# Altium schematic sheet CAN.SchDoc: QUTMS - HVBoard - CANBUS
size A4; Author: Jonn Dillon; Organization: QUT Motorsport; Address1: O-120; Address2: O Block; Address3: QUT Gardens Point; Address4: Brisbane, 4000; DocumentNumber: 1; SheetNumber: 1; SheetTotal: 7
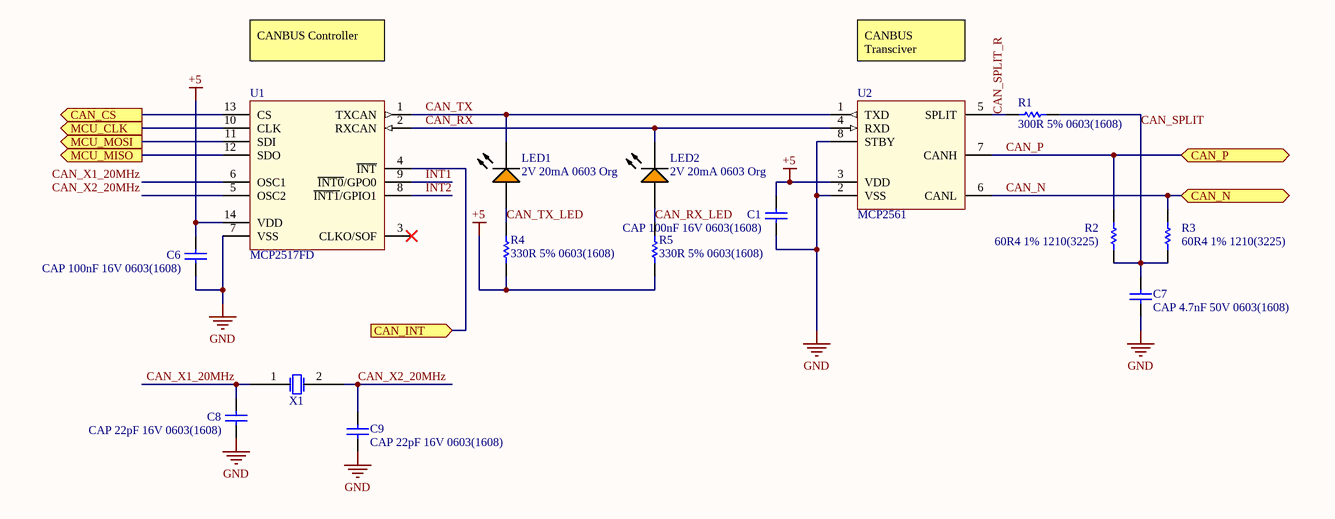
[diagram p0: CAN.SchDoc]

## Parts
C1  CAP 100nF 16V 0603(1608)  [CAPC0603(1608)100_N]
C6  CAP 100nF 16V 0603(1608)  [CAPC0603(1608)100_N]
C7  CAP 4.7nF 50V 0603(1608)  [CAPC0603(1608)100_M]
C8  CAP 22pF 16V 0603(1608)  [CAPC0603(1608)100_N]
C9  CAP 22pF 16V 0603(1608)  [CAPC0603(1608)100_N]
LED1  2V 20mA 0603 Org  [KING-LED0603-25-ORANGE_V]
LED2  2V 20mA 0603 Org  [KING-LED0603-25-ORANGE_V]
R1  300R 5% 0603(1608)  [RESC0603(1608)_N]
R2  60R4 1% 1210(3225)  [RESC1210(3225)_L]
R3  60R4 1% 1210(3225)  [RESC1210(3225)_L]
R4  330R 5% 0603(1608)  [RESC0603(1608)_L]
R5  330R 5% 0603(1608)  [RESC0603(1608)_L]
U1  MCP2517FD  [MCP2517FD SOIC]
U2  MCP2561  [MCP2561 SOIC]
X1  Crystal 20MHz  [Crystal 20MHz]  (value not drawn)

## Ports
CAN_CS (out), CAN_INT (in), CAN_N (bidir), CAN_P (bidir), MCU_CLK (out), MCU_MISO (out), MCU_MOSI (out)

## Nets
+5: C1.2 C6.2 R4.2 R5.2 U1.14(VDD) U2.3(VDD)
GND: C1.1 C6.1 C7.1 C8.1 C9.2 U1.7(VSS) U2.2(VSS) U2.8(STBY)
CAN_CS: U1.13(CS) ; port CAN_CS
CAN_INT: U1.4(~{INT}) ; port CAN_INT
CAN_N: R3.2 U2.6(CANL) ; port CAN_N
CAN_P: R2.2 U2.7(CANH) ; port CAN_P
CAN_RX: LED2.2(K) U1.2(RXCAN) U2.4(RXD)
CAN_RX_LED: LED2.1(A) R5.1
CAN_SPLIT: C7.2 R1.2 R2.1 R3.1
CAN_SPLIT_R: R1.1 U2.5(SPLIT)
CAN_TX: LED1.2(K) U1.1(TXCAN) U2.1(TXD)
CAN_TX_LED: LED1.1(A) R4.1
CAN_X1_20MHz: C8.2 U1.6(OSC1) X1.1
CAN_X2_20MHz: C9.1 U1.5(OSC2) X1.2
INT1: U1.9(~{INT0}/GPO0)
INT2: U1.8(~{INT1}/GPIO1)
MCU_CLK: U1.10(CLK) ; port MCU_CLK
MCU_MISO: U1.12(SDO) ; port MCU_MISO
MCU_MOSI: U1.11(SDI) ; port MCU_MOSI

Not connected (* = marked no-connect by the designer): U1 3(CLKO/SOF)*

## Notes on the sheet
- CANBUS Controller
- CANBUS Transciver
- Title
- Size:
- Date:
- A4
- Number:
- Time:
- Revision:
- Sheet
- of
- File:

## Library data of the parts
C1 C6 = CMP-1035-02584-1: CAP 100nF 16V ±10% 0603 (1608 Metric) Thickness 1mm SMD; Tolerance: Â±10%; Case-EIA: 0603; Case-Metric: 1608; Technology: SMT; Max Thickness: 1 mm; Value: 100nF; Rated Voltage: 16 V
C7 = CMP-1035-02202-1: CAP 4.7nF 50V ±5% 0603 (1608 Metric) Thickness 1mm SMD; Case-Metric: 1608; Case-EIA: 0603; Tolerance: Â±5%; Value: 4.7nF; Rated Voltage: 50 V; Technology: SMT; Max Thickness: 1 mm
C8 C9 = CMP-1035-00808-1: CAP 22pF 16V ±5% 0603 (1608 Metric) Thickness 1mm SMD; Tolerance: Â±5%; Case-EIA: 0603; Case-Metric: 1608; Technology: SMT; Value: 22pF; Rated Voltage: 16 V; Max Thickness: 1 mm
LED1 LED2 = CMP-0239-00002-1: LED, SMT, 0603(1608), 0.25mm Tthickness, Super Bright Orange; PartNumber: APG1608SEKC/T; Forward Current: 30 mA; Power Dissipation: 75 mW; Reverse Voltage: 5 V; Packing: Reel; PackageDescription: 2-Pin SMT LED, 1.6 x 0.8 mm Body, 0.25mm Thickness; ComponentLink1URL: http://www.kingbrightusa.com/; PackageVersion: Rev. 4A, 12/2011; Storage Temperature: -40 to 85 degC; Mounting Technology: Surface Mount; ComponentLink2Description: Datasheet; DatasheetVersion: Rev. 4A, 12/2011; ComponentLink2URL: http://www.kingbrightusa.com/images/catalog/SPEC/APG1608SEKC-T.pdf; PackageReference: LED0603-25-ORANGE; ComponentLink1Description: Manufacturer URL
R1 = CMP-1012-00061-1: 300R 0.1W 5% 0603 (1608 Metric)  SMD; Case-EIA: 0603; Value: 300.00 Ohm; Case-Metric: 1608; Tolerance: 5 %; Power: 0.1 W; Technology: SMT
R2 R3 = CMP-1015-00372-1: 60R4 0.5W 1% 1210 (3225 Metric)  SMD; Case-Metric: 3225; Case-EIA: 1210; Value: 60.40 Ohm; Technology: SMT; Tolerance: 1 %; Power: 0.5 W
R4 R5 = CMP-1012-00062-1: 330R 0.1W 5% 0603 (1608 Metric)  SMD; Value: 330.00 Ohm; Case-EIA: 0603; Case-Metric: 1608; Tolerance: 5 %; Power: 0.1 W; Technology: SMT
X1 = Crystal 20MHz: ComponentLink1Description: Datasheet; ComponentLink1URL: http://cfd.citizen.co.jp/english/prod-tech/product/pdf/datasheet_AT/HCM49_E.pdf